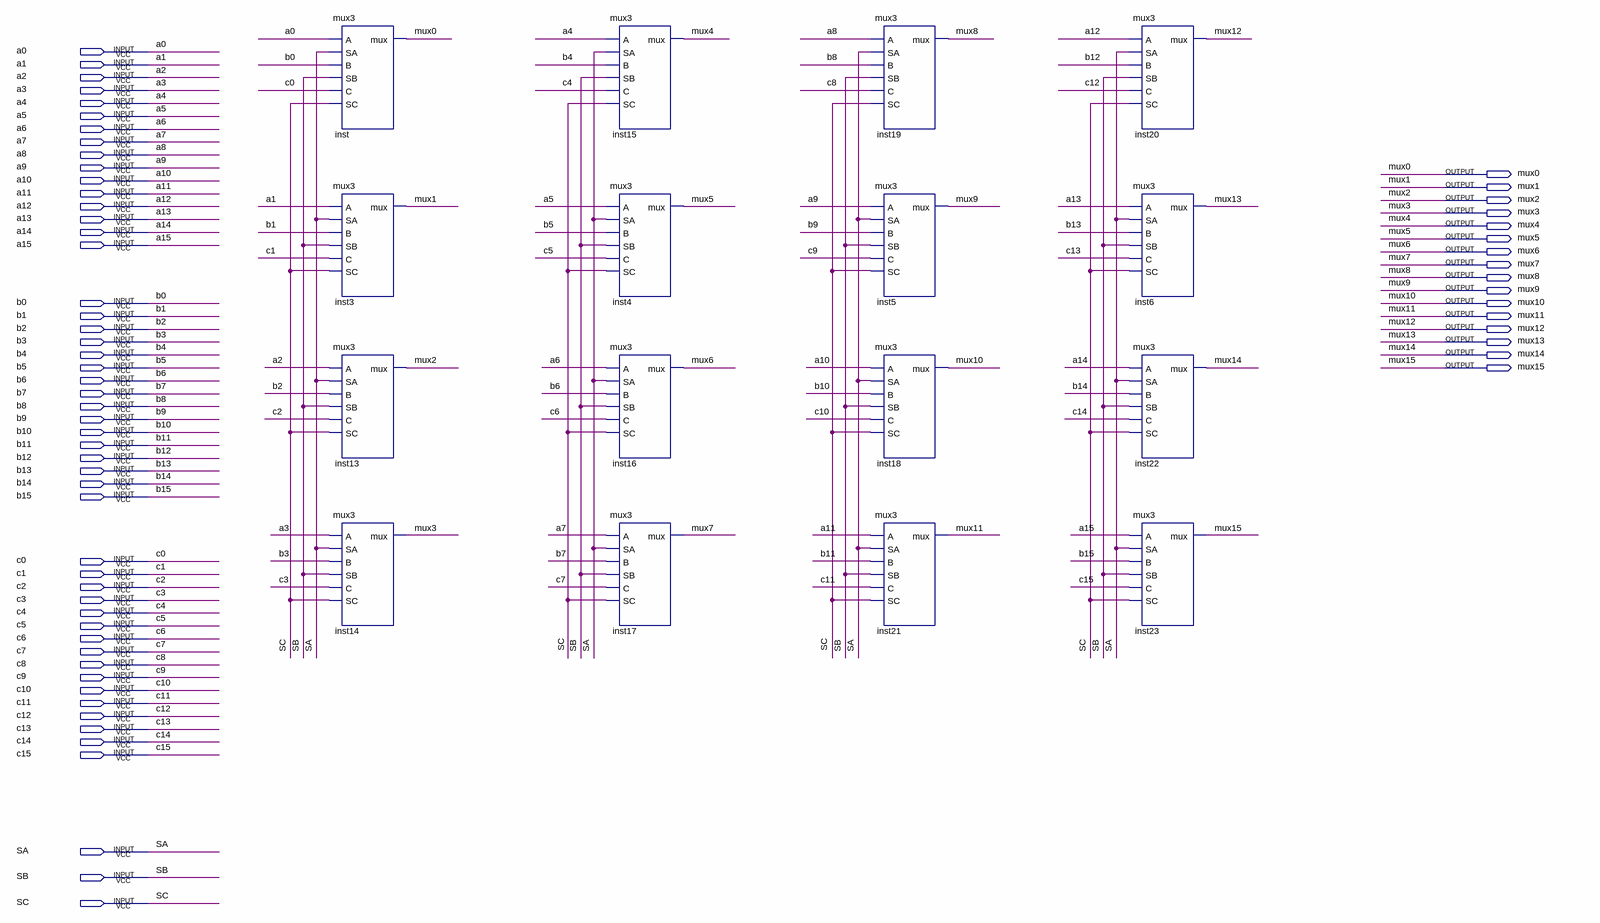
[diagram p0: schematic sheet]
// Quartus schematic 3mux1_16.bdf as structural Verilog: 16 symbols, 67 pins
module \3mux1_16  (
  input  a0,
  input  a1,
  input  a2,
  input  a3,
  input  a4,
  input  a5,
  input  a6,
  input  a7,
  input  a8,
  input  a9,
  input  a10,
  input  a11,
  input  a12,
  input  a13,
  input  a14,
  input  a15,
  input  b0,
  input  b1,
  input  b2,
  input  b3,
  input  b4,
  input  b5,
  input  b6,
  input  b7,
  input  b8,
  input  b9,
  input  b10,
  input  b11,
  input  b12,
  input  b13,
  input  b14,
  input  b15,
  input  c0,
  input  c1,
  input  c2,
  input  c3,
  input  c4,
  input  c5,
  input  c6,
  input  c7,
  input  c8,
  input  c9,
  input  c10,
  input  c11,
  input  c12,
  input  c13,
  input  c14,
  input  c15,
  input  SA,
  input  SB,
  input  SC,
  output mux0,
  output mux1,
  output mux2,
  output mux3,
  output mux4,
  output mux5,
  output mux6,
  output mux7,
  output mux8,
  output mux9,
  output mux10,
  output mux11,
  output mux12,
  output mux13,
  output mux14,
  output mux15
);

  mux3 inst (.A(a0), .SA(SA), .B(b0), .SB(SB), .C(c0), .SC(SC), .mux(mux0));
  mux3 inst3 (.A(a1), .SA(SA), .B(b1), .SB(SB), .C(c1), .SC(SC), .mux(mux1));
  mux3 inst13 (.A(a2), .SA(SA), .B(b2), .SB(SB), .C(c2), .SC(SC), .mux(mux2));
  mux3 inst14 (.A(a3), .SA(SA), .B(b3), .SB(SB), .C(c3), .SC(SC), .mux(mux3));
  mux3 inst15 (.A(a4), .SA(SA), .B(b4), .SB(SB), .C(c4), .SC(SC), .mux(mux4));
  mux3 inst4 (.A(a5), .SA(SA), .B(b5), .SB(SB), .C(c5), .SC(SC), .mux(mux5));
  mux3 inst16 (.A(a6), .SA(SA), .B(b6), .SB(SB), .C(c6), .SC(SC), .mux(mux6));
  mux3 inst17 (.A(a7), .SA(SA), .B(b7), .SB(SB), .C(c7), .SC(SC), .mux(mux7));
  mux3 inst19 (.A(a8), .SA(SA), .B(b8), .SB(SB), .C(c8), .SC(SC), .mux(mux8));
  mux3 inst5 (.A(a9), .SA(SA), .B(b9), .SB(SB), .C(c9), .SC(SC), .mux(mux9));
  mux3 inst18 (.A(a10), .SA(SA), .B(b10), .SB(SB), .C(c10), .SC(SC), .mux(mux10));
  mux3 inst21 (.A(a11), .SA(SA), .B(b11), .SB(SB), .C(c11), .SC(SC), .mux(mux11));
  mux3 inst20 (.A(a12), .SA(SA), .B(b12), .SB(SB), .C(c12), .SC(SC), .mux(mux12));
  mux3 inst6 (.A(a13), .SA(SA), .B(b13), .SB(SB), .C(c13), .SC(SC), .mux(mux13));
  mux3 inst22 (.A(a14), .SA(SA), .B(b14), .SB(SB), .C(c14), .SC(SC), .mux(mux14));
  mux3 inst23 (.A(a15), .SA(SA), .B(b15), .SB(SB), .C(c15), .SC(SC), .mux(mux15));
endmodule
